# Altium schematic sheet Potenta connections.SchDoc
size A4; Organization: Mirion Technologies (Canberra Olen) NV; Address1: Lammerdries-Oost 25; Address2: 2250; Address3: Olen; Address4: Belgium; ENG_APP_DATE: --/--/--; DSN_APP_DATE: --/--/--; CHK_APP_DATE: --/--/--
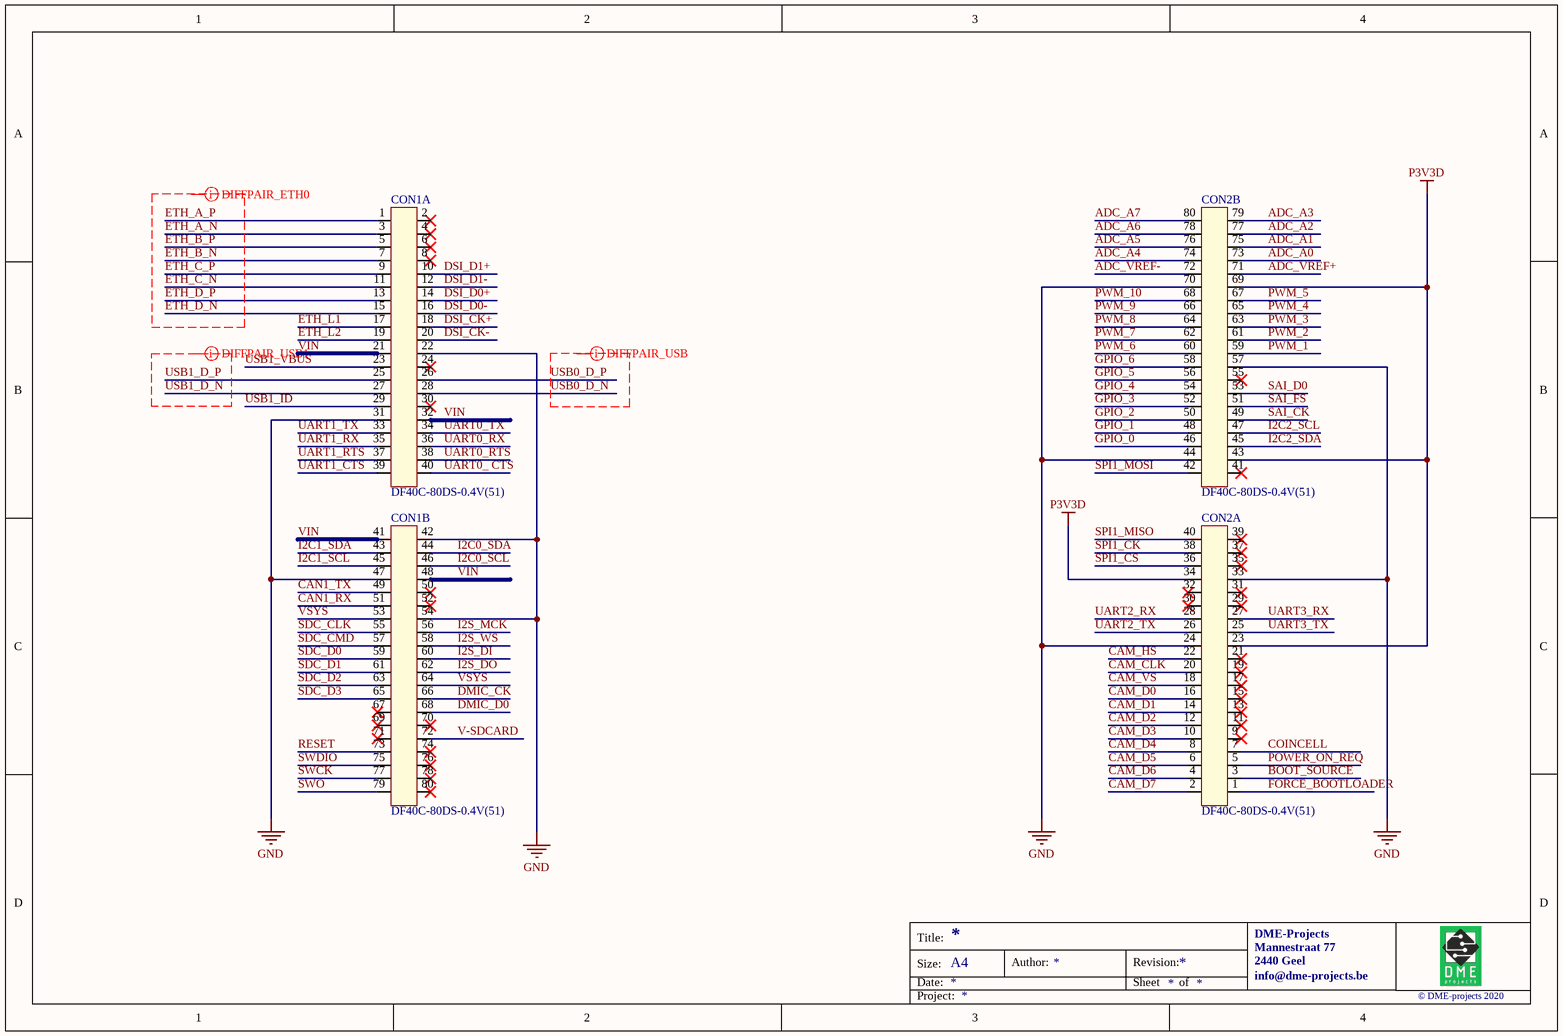
[diagram p0: Potenta connections.SchDoc]

## Parts
CON1  DF40C-80DS-0.4V(51)  [DF40C-80DS-0.4V(51)-Footprint-1]  (parts A,B of 2)
CON2  DF40C-80DS-0.4V(51)  [DF40C-80DS-0.4V(51)-Footprint-1]  (parts A,B of 2)

## Nets
GND: CON1.22 CON1.31 CON1.42 CON1.47 CON1.54 CON2.24 CON2.33 CON2.44 CON2.57 CON2.70
P3V3D: CON2.23 CON2.34 CON2.43 CON2.69
ADC_A0: CON2.73
ADC_A1: CON2.75
ADC_A2: CON2.77
ADC_A3: CON2.79
ADC_A4: CON2.74
ADC_A5: CON2.76
ADC_A6: CON2.78
ADC_A7: CON2.80
ADC_VREF+: CON2.71
ADC_VREF-: CON2.72
BOOT_SOURCE: CON2.3
CAM_CLK: CON2.20
CAM_D0: CON2.16
CAM_D1: CON2.14
CAM_D2: CON2.12
CAM_D3: CON2.10
CAM_D4: CON2.8
CAM_D5: CON2.6
CAM_D6: CON2.4
CAM_D7: CON2.2
CAM_HS: CON2.22
CAM_VS: CON2.18
CAN1_RX: CON1.51
CAN1_TX: CON1.49
COINCELL: CON2.7
DMIC_CK: CON1.66
DMIC_D0: CON1.68
DSI_CK+: CON1.18
DSI_CK-: CON1.20
DSI_D0+: CON1.14
DSI_D0-: CON1.16
DSI_D1+: CON1.10
DSI_D1-: CON1.12
ETH_A_N: CON1.3
ETH_A_P: CON1.1
ETH_B_N: CON1.7
ETH_B_P: CON1.5
ETH_C_N: CON1.11
ETH_C_P: CON1.9
ETH_D_N: CON1.15
ETH_D_P: CON1.13
ETH_L1: CON1.17
ETH_L2: CON1.19
FORCE_BOOTLOADER: CON2.1
GPIO_0: CON2.46
GPIO_1: CON2.48
GPIO_2: CON2.50
GPIO_3: CON2.52
GPIO_4: CON2.54
GPIO_5: CON2.56
GPIO_6: CON2.58
I2C0_SCL: CON1.46
I2C0_SDA: CON1.44
I2C1_SCL: CON1.45
I2C1_SDA: CON1.43
I2C2_SCL: CON2.47
I2C2_SDA: CON2.45
I2S_DI: CON1.60
I2S_DO: CON1.62
I2S_MCK: CON1.56
I2S_WS: CON1.58
POWER_ON_REQ: CON2.5
PWM_1: CON2.59
PWM_2: CON2.61
PWM_3: CON2.63
PWM_4: CON2.65
PWM_5: CON2.67
PWM_6: CON2.60
PWM_7: CON2.62
PWM_8: CON2.64
PWM_9: CON2.66
PWM_10: CON2.68
RESET: CON1.73
SAI_CK: CON2.49
SAI_D0: CON2.53
SAI_FS: CON2.51
SDC_CLK: CON1.55
SDC_CMD: CON1.57
SDC_D0: CON1.59
SDC_D1: CON1.61
SDC_D2: CON1.63
SDC_D3: CON1.65
SPI1_CK: CON2.38
SPI1_CS: CON2.36
SPI1_MISO: CON2.40
SPI1_MOSI: CON2.42
SWCK: CON1.77
SWDIO: CON1.75
SWO: CON1.79
UART0_ CTS: CON1.40
UART0_RTS: CON1.38
UART0_RX: CON1.36
UART0_TX: CON1.34
UART1_CTS: CON1.39
UART1_RTS: CON1.37
UART1_RX: CON1.35
UART1_TX: CON1.33
UART2_RX: CON2.28
UART2_TX: CON2.26
UART3_RX: CON2.27
UART3_TX: CON2.25
USB0_D_N: CON1.28
USB0_D_P: CON1.26
USB1_D_N: CON1.27
USB1_D_P: CON1.25
USB1_ID: CON1.29
USB1_VBUS: CON1.23
V-SDCARD: CON1.72
VIN: CON1.21 CON1.32 CON1.41 CON1.48
VSYS: CON1.53 CON1.64

Not connected (* = marked no-connect by the designer): CON1 2* 4* 6* 8* 24* 30* 50* 52* 67* 69* 70* 71* 74* 76* 78* 80*; CON2 9* 11* 13* 15* 17* 19* 21* 29* 30* 31* 32* 35* 37* 39* 41* 55*

## Layout directives
differential pair; differential pair class DIFFPAIR_ETH0: ETH_A_N, ETH_A_P, ETH_B_N, ETH_B_P, ETH_C_N, ETH_C_P, ETH_D_N, ETH_D_P
differential pair; differential pair class DIFFPAIR_USB: USB0_D_N, USB0_D_P, USB1_D_N, USB1_D_P

## Notes on the sheet
- Title:
- Size:
- Date:
- A4
- Author:
- Revision:
- Sheet
- of
- DME-Projects
- Mannestraat 77
- 2440 Geel
- info@dme-projects.be
- Project:
- © DME-projects 2020

## Library data of the parts
CON1 CON2 = CMP-00029-4: DF40 Series 80 Positions 0.4 mm Pitch Dual Row SMT Receptacle Connector; Number of Contacts: 80; Mated Stacking Heights: 1.5mm; Pitch: 0.4mm; Current Rating: 300mA; Voltage Rating: 30V; Number of Rows: 2; Package Quantity: 1; Contact Material: Bronze; Housing Material: Polymer; Mount: Surface Mount; Connector Type: Receptacle; REACH SVHC: Unknown; Contact Plating: Gold; Lead Free: Lead Free; Radiation Hardening: No; Packaging: Tape and Reel; Gender: Receptacle; Termination: SMD/SMT; Number of Positions: 80; PartId: 1